# Altium schematic sheet 3_powerstage.SchDoc
size A; SheetNumber: 3; SheetTotal: 9
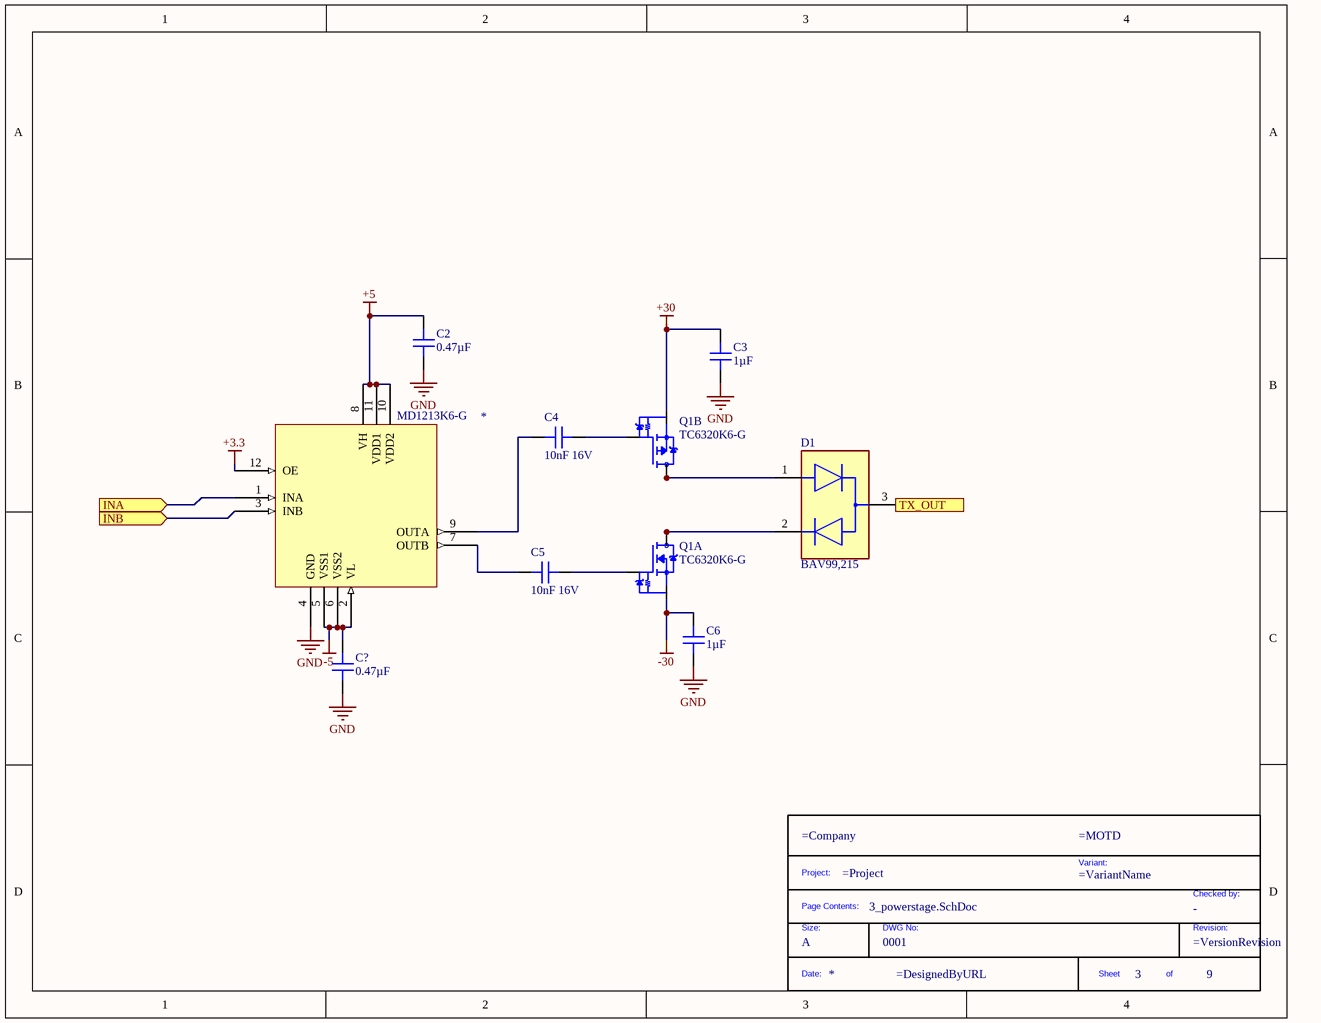
[diagram p0: 3_powerstage.SchDoc]

## Parts
*  MD1213K6-G  [QFN80P400X400X90-13N]
*?  DWG No: 0001  Size: A  (hidden comment: TitleBlock)  (graphical)
C2  0.47µF  [CAP 1206_3216 - 1.8MM]
C3  1µF  [CAP 1206_3216 - 1.8MM]
C4  10nF 16V  [CAP 1206_3216 - 1.0MM]
C5  10nF 16V  [CAP 1206_3216 - 1.0MM]
C6  1µF  [CAP 1206_3216 - 1.8MM]
C?  0.47µF  [CAP 1206_3216 - 1.8MM]
D1  BAV99,215  [FP-SOT23-MFG]
Q1  TC6320K6-G  [SON100P400X400X100-10N]  (parts A,B of 2)

## Ports
INA (in), INB (in), TX_OUT (out)

## Nets
+3.3: *.12(OE)
+5: *.8(VH) *.10(VDD2) *.11(VDD1) C2.2
+30: C3.2 Q1.4(SP)
-5: *.2(VL) *.5(VSS1) *.6(VSS2) C?.2
-30: C6.2 Q1.1(SN)
GND: *.4(GND) C2.1 C3.1 C6.1 C?.1
INA: *.1(INA) ; port INA
INB: *.3(INB) ; port INB
TX_OUT: D1.3 ; port TX_OUT
Net*_7: *.7(OUTB) C5.1
Net*_9: *.9(OUTA) C4.1
NetC4_2: C4.2 Q1.3(GP)
NetC5_2: C5.2 Q1.2(GN)
NetD1_1: D1.1 Q1.5(DP) Q1.6(DP) Q1.10(DP)
NetD1_2: D1.2 Q1.7(DN) Q1.8(DN) Q1.9(DN)

## Notes on the sheet
- (in symbol TitleBlock) Project:; Variant:; Checked by:; Page Contents:; Size:; DWG No:; Revision:; Date:; Sheet; of

## Library data of the parts
* = CMP-024-00000-1: Driver 2A 2-OUT High and Low Side Inv 12-Pin QFN EP T/R; Frequency: 100kHz; Channel Type: Independent; Fall Time: 6ns; Case/Package: QFN
*? = TitleBlock: Standard Title Block; Checked by: -
C2 C? = 12063C474KAT2A: CAP CER 0.47UF 25V X7R 1206; manufacturer: AVX Corporation; Tolerance: ±10%; Part Number: 12063C474KAT2A; Value: 0.47µF; Applications: General Purpose; Capacitance: 0.47µF; componentlink1description: Datasheet; componentlink1url: http://datasheets.avx.com/X7RDielectric.pdf; componentlink2description: DigiKey Link; componentlink2url: http://digikey.com/product-detail/en/avx-corporation/12063C474KAT2A/478-1563-1-ND/564595; Device Package: 1206 (3216 Metric); lastupdated: 2020-09-02 01:05:39; Lifecycle Status: Active; Minimum Order: 1; Mounting Type: Surface Mount, MLCC; Operating Temperature: -55°C ~ 125°C; Package / Case: 1206 (3216 Metric); packaging: TapeAndReel; partid: 20474; Part Status: Active; price: 0.08; series: -; Size / Dimension: 0.126" L x 0.063" W (3.20mm x 1.60mm); Supplier 1: DigiKey; Supplier Part Number 1: 478-1563-1-ND; Temperature Coefficient: X7R; Thickness (Max): 0.050" (1.27mm); Voltage - Rated: 25V
C3 C6 = 12063G105ZAT2A: CAP CER 1UF 25V Y5V 1206; manufacturer: AVX Corporation; Temperature Coefficient: Y5V (F); Tolerance: -20%, +80%; Part Number: 12063G105ZAT2A; Value: 1µF; Applications: General Purpose; Capacitance: 1µF; componentlink1description: Datasheet; componentlink1url: http://datasheets.avx.com/Y5V.pdf; componentlink2description: DigiKey Link; componentlink2url: http://digikey.com/product-detail/en/avx-corporation/12063G105ZAT2A/478-5906-1-ND/2177838; Device Package: 1206 (3216 Metric); lastupdated: 2020-09-02 01:05:35; Lifecycle Status: Active; Minimum Order: 1; Mounting Type: Surface Mount, MLCC; Operating Temperature: -30°C ~ 85°C; Package / Case: 1206 (3216 Metric); packaging: TapeAndReel; partid: 21454; Part Status: Active; price: 0.07; series: -; Size / Dimension: 0.126" L x 0.063" W (3.20mm x 1.60mm); Supplier 1: DigiKey; Supplier Part Number 1: 478-5906-1-ND; Thickness (Max): 0.050" (1.27mm); Voltage - Rated: 25V
C4 C5 = 12061C103KAT2A: CAP CER 10000PF 100V X7R 1206; manufacturer: AVX Corporation; Tolerance: ±10%; Part Number: 12061C103KAT2A; Value: 10nF 16V; Applications: General Purpose; Capacitance: 10000pF; componentlink1description: Datasheet; componentlink1url: http://datasheets.avx.com/X7RDielectric.pdf; componentlink2description: DigiKey Link; componentlink2url: http://digikey.com/product-detail/en/avx-corporation/12061C103KAT2A/478-1523-1-ND/564555; Device Package: 1206 (3216 Metric); lastupdated: 2020-09-02 01:05:00; Lifecycle Status: Active; Minimum Order: 1; Mounting Type: Surface Mount, MLCC; Operating Temperature: -55°C ~ 125°C; Package / Case: 1206 (3216 Metric); packaging: TapeAndReel; partid: 20306; Part Status: Active; price: 0.06; series: -; Size / Dimension: 0.126" L x 0.063" W (3.20mm x 1.60mm); Supplier 1: DigiKey; Supplier Part Number 1: 478-1523-1-ND; Temperature Coefficient: X7R; Thickness (Max): 0.037" (0.94mm); Voltage - Rated: 100V
D1 = CMP-14399-000006-1: DIODE ARRAY GP 100V 215MA SOT23
Q1 = TC6320K6-G: Mosfet Array N and P-Channel 200V Surface Mount 8-DFN (4x4); MF: {'manufacturer': u'Microchip Technology / Atmel'}; MP: TC6320K6-G; Package: None; Availability: Unavailable; Value: *; Price: None